# EAGLE schematic analog-io-breakout (EAGLE 8.3.2)
DESIGNER: JAKOB VOIGTS & JON NEWMAN; DESIGN_NAME: BREAKOUT BOARD; LICENSE: CERN OHL v1.2; REVISION: 1.0
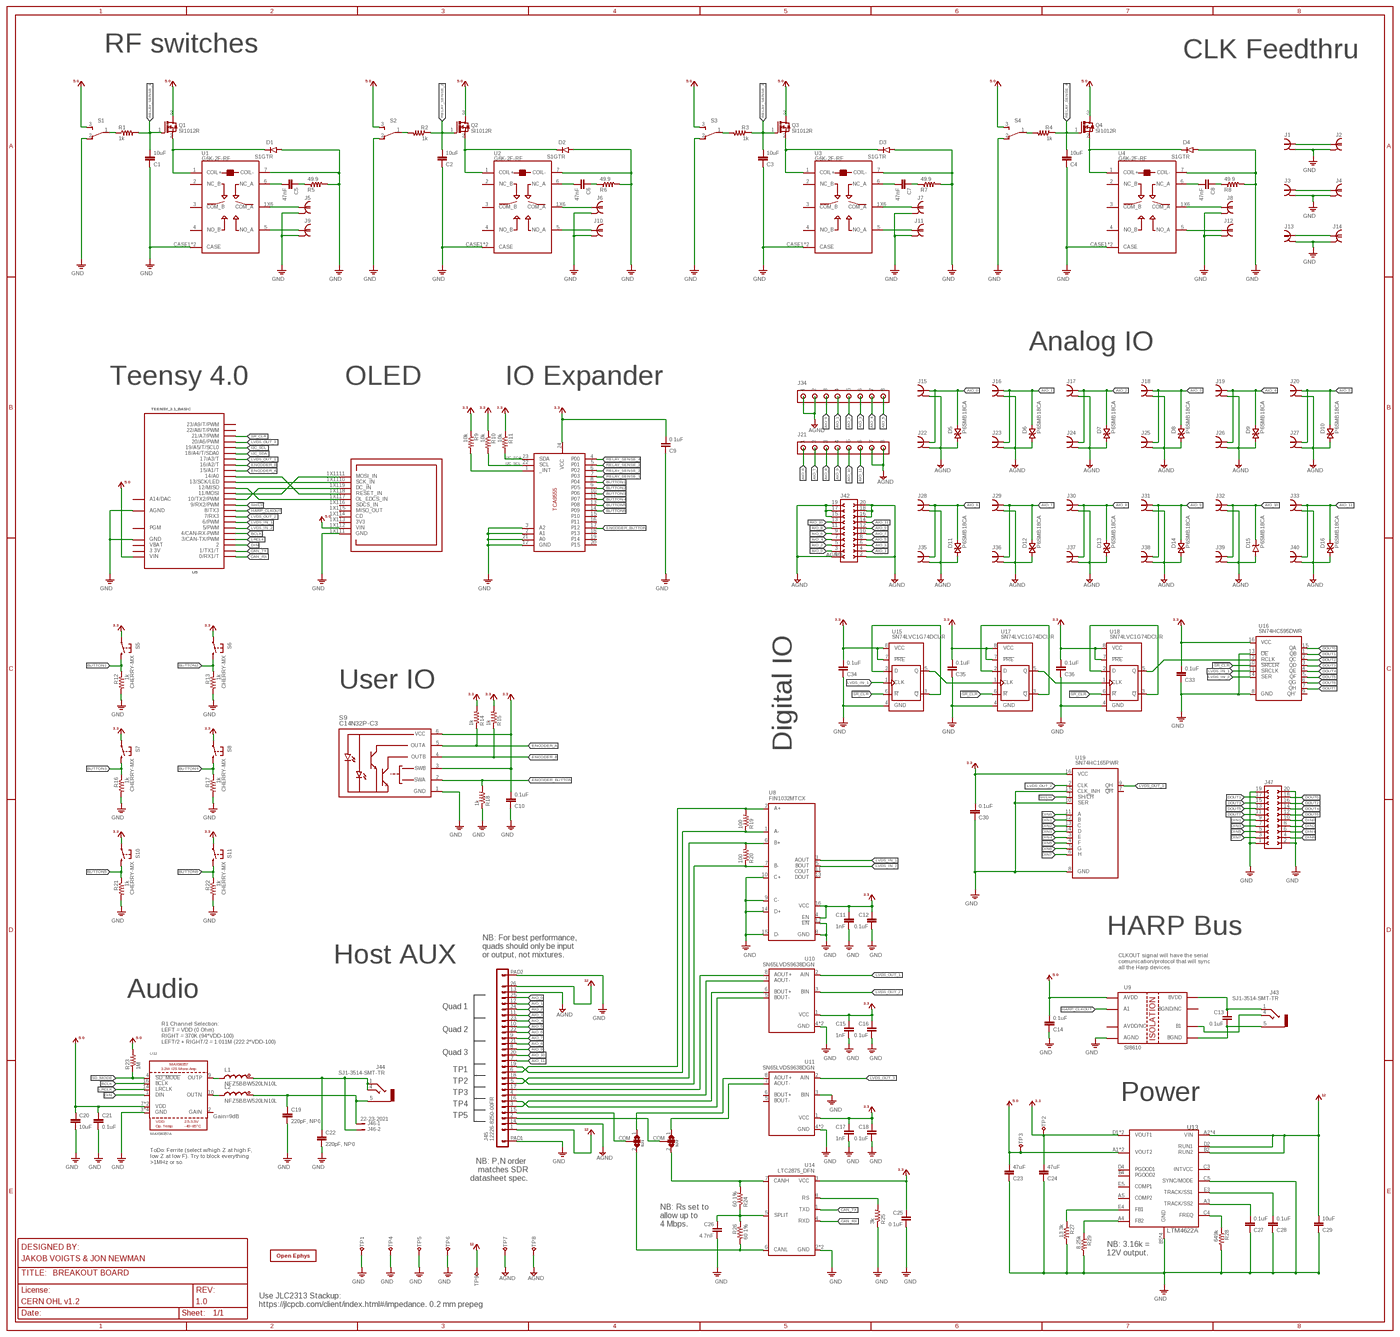
[diagram p0: schematic, sheet 1, overview]
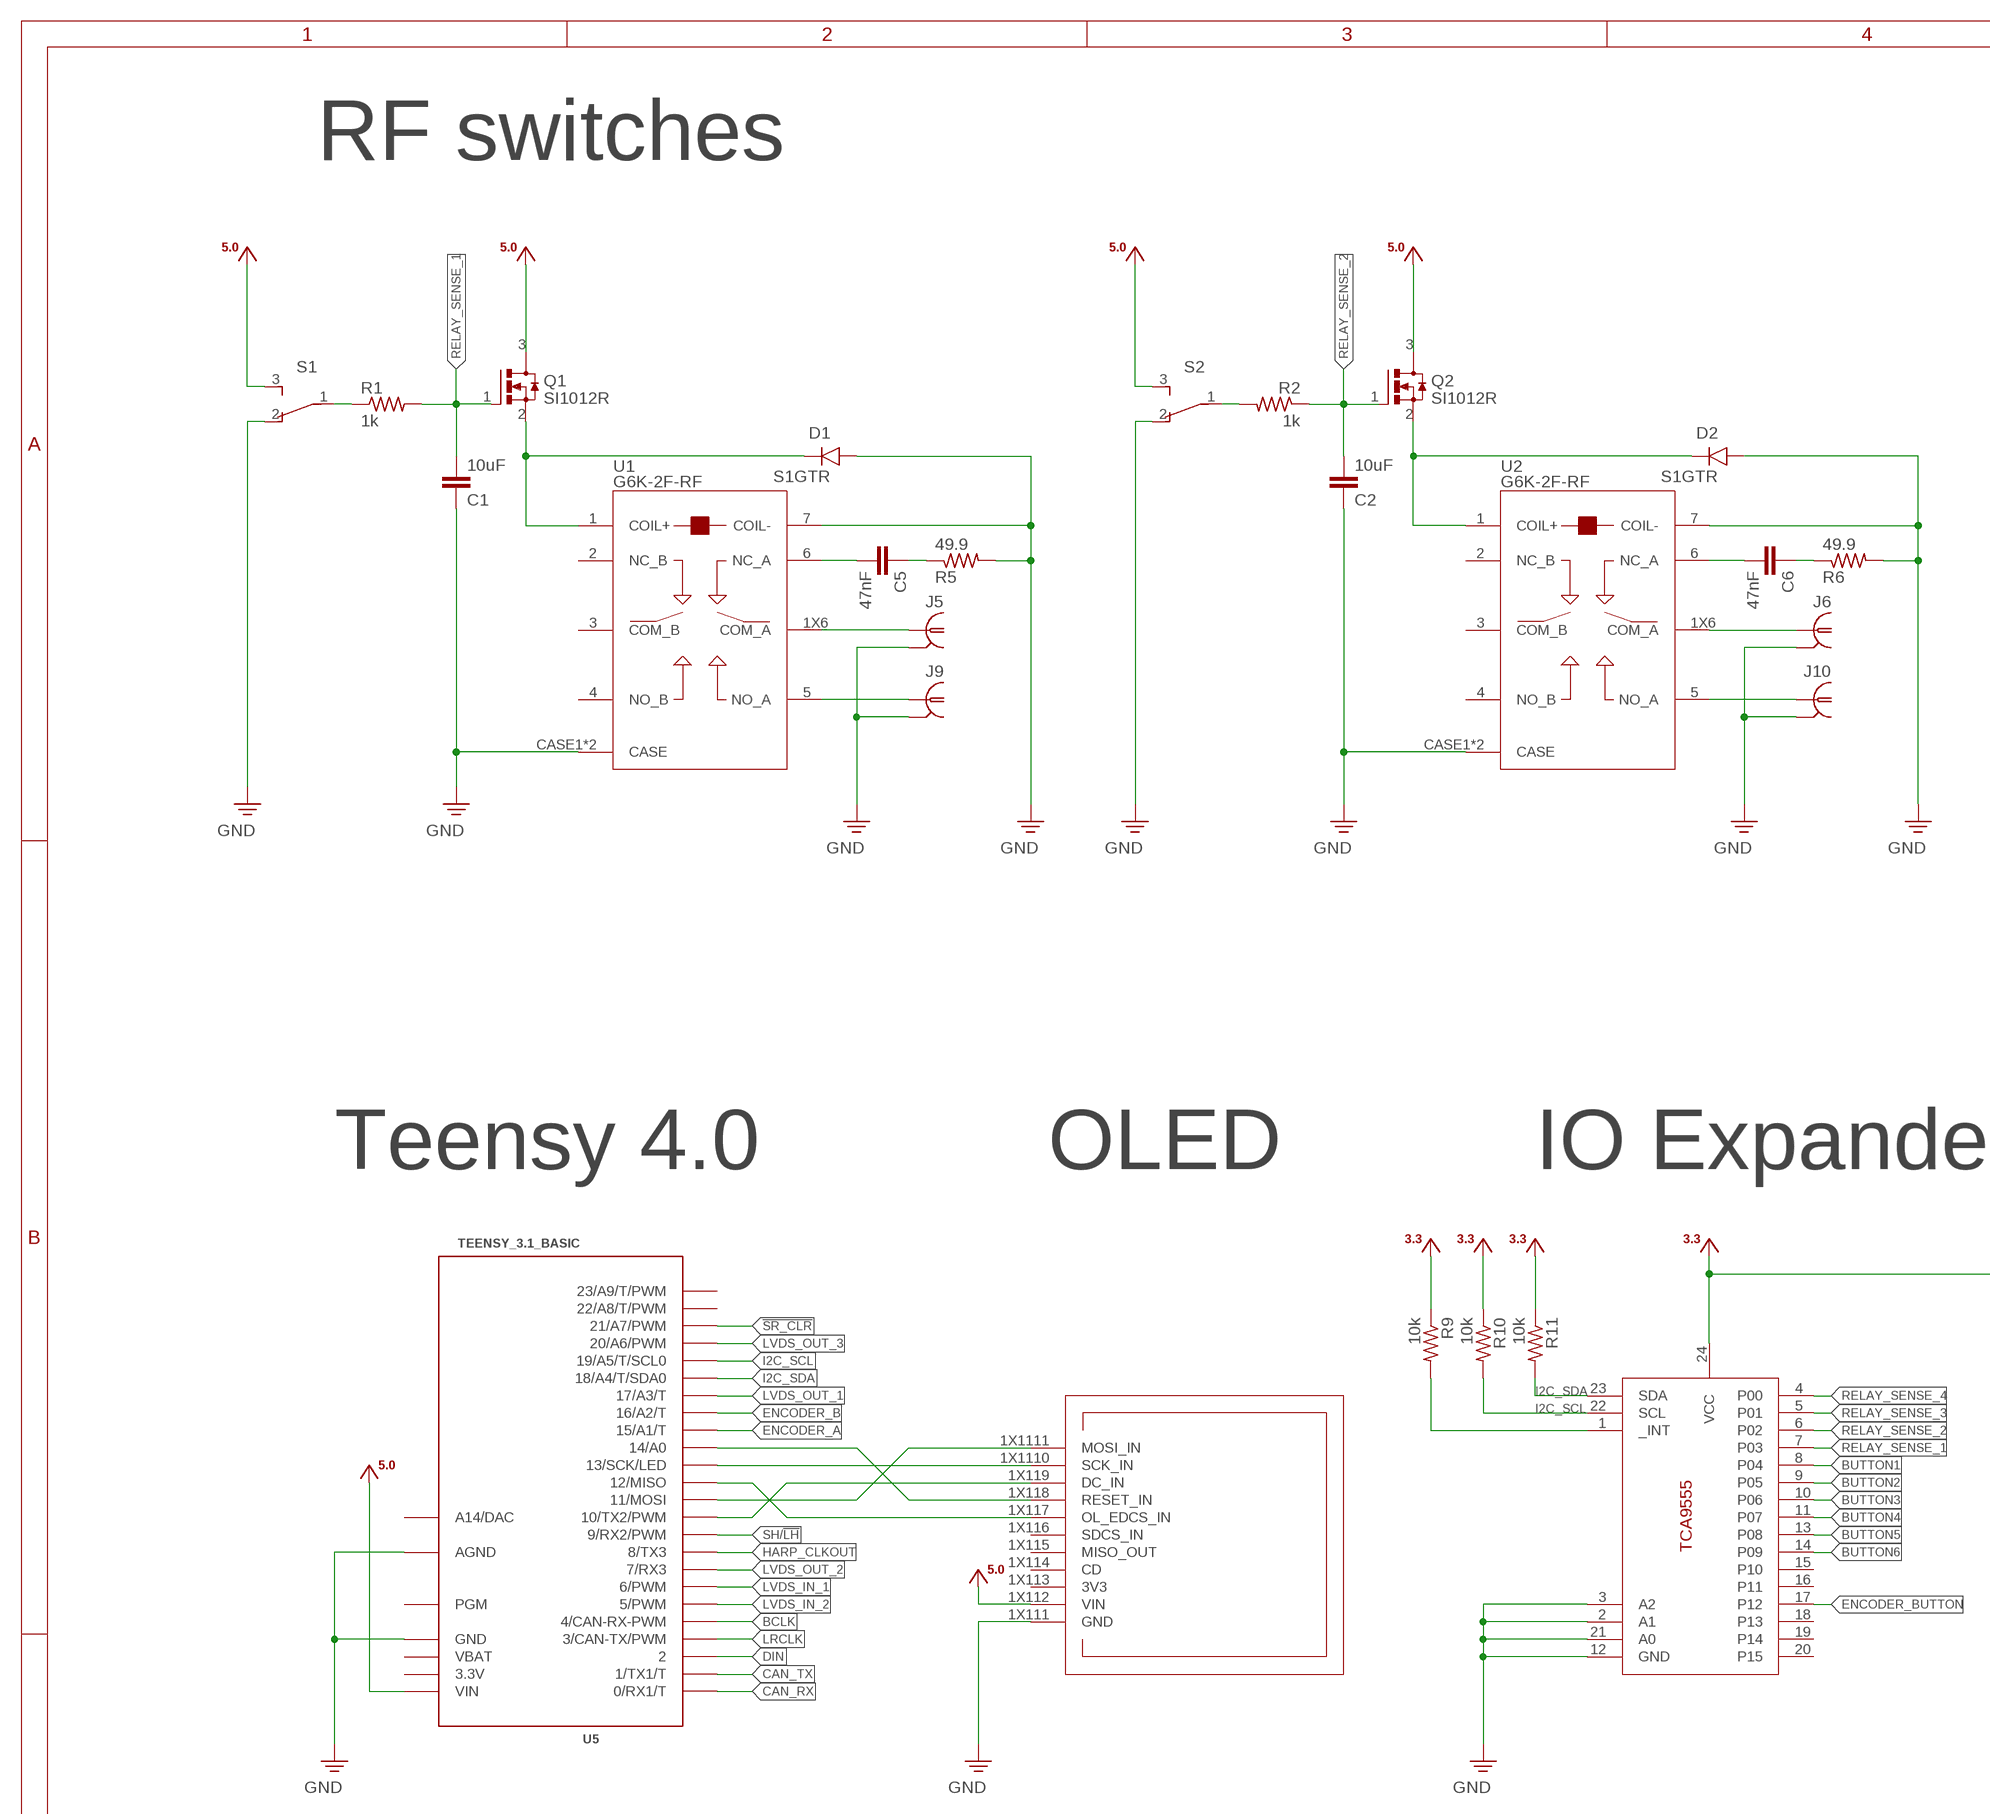
[diagram p1: schematic, sheet 1, part 1 of 4]
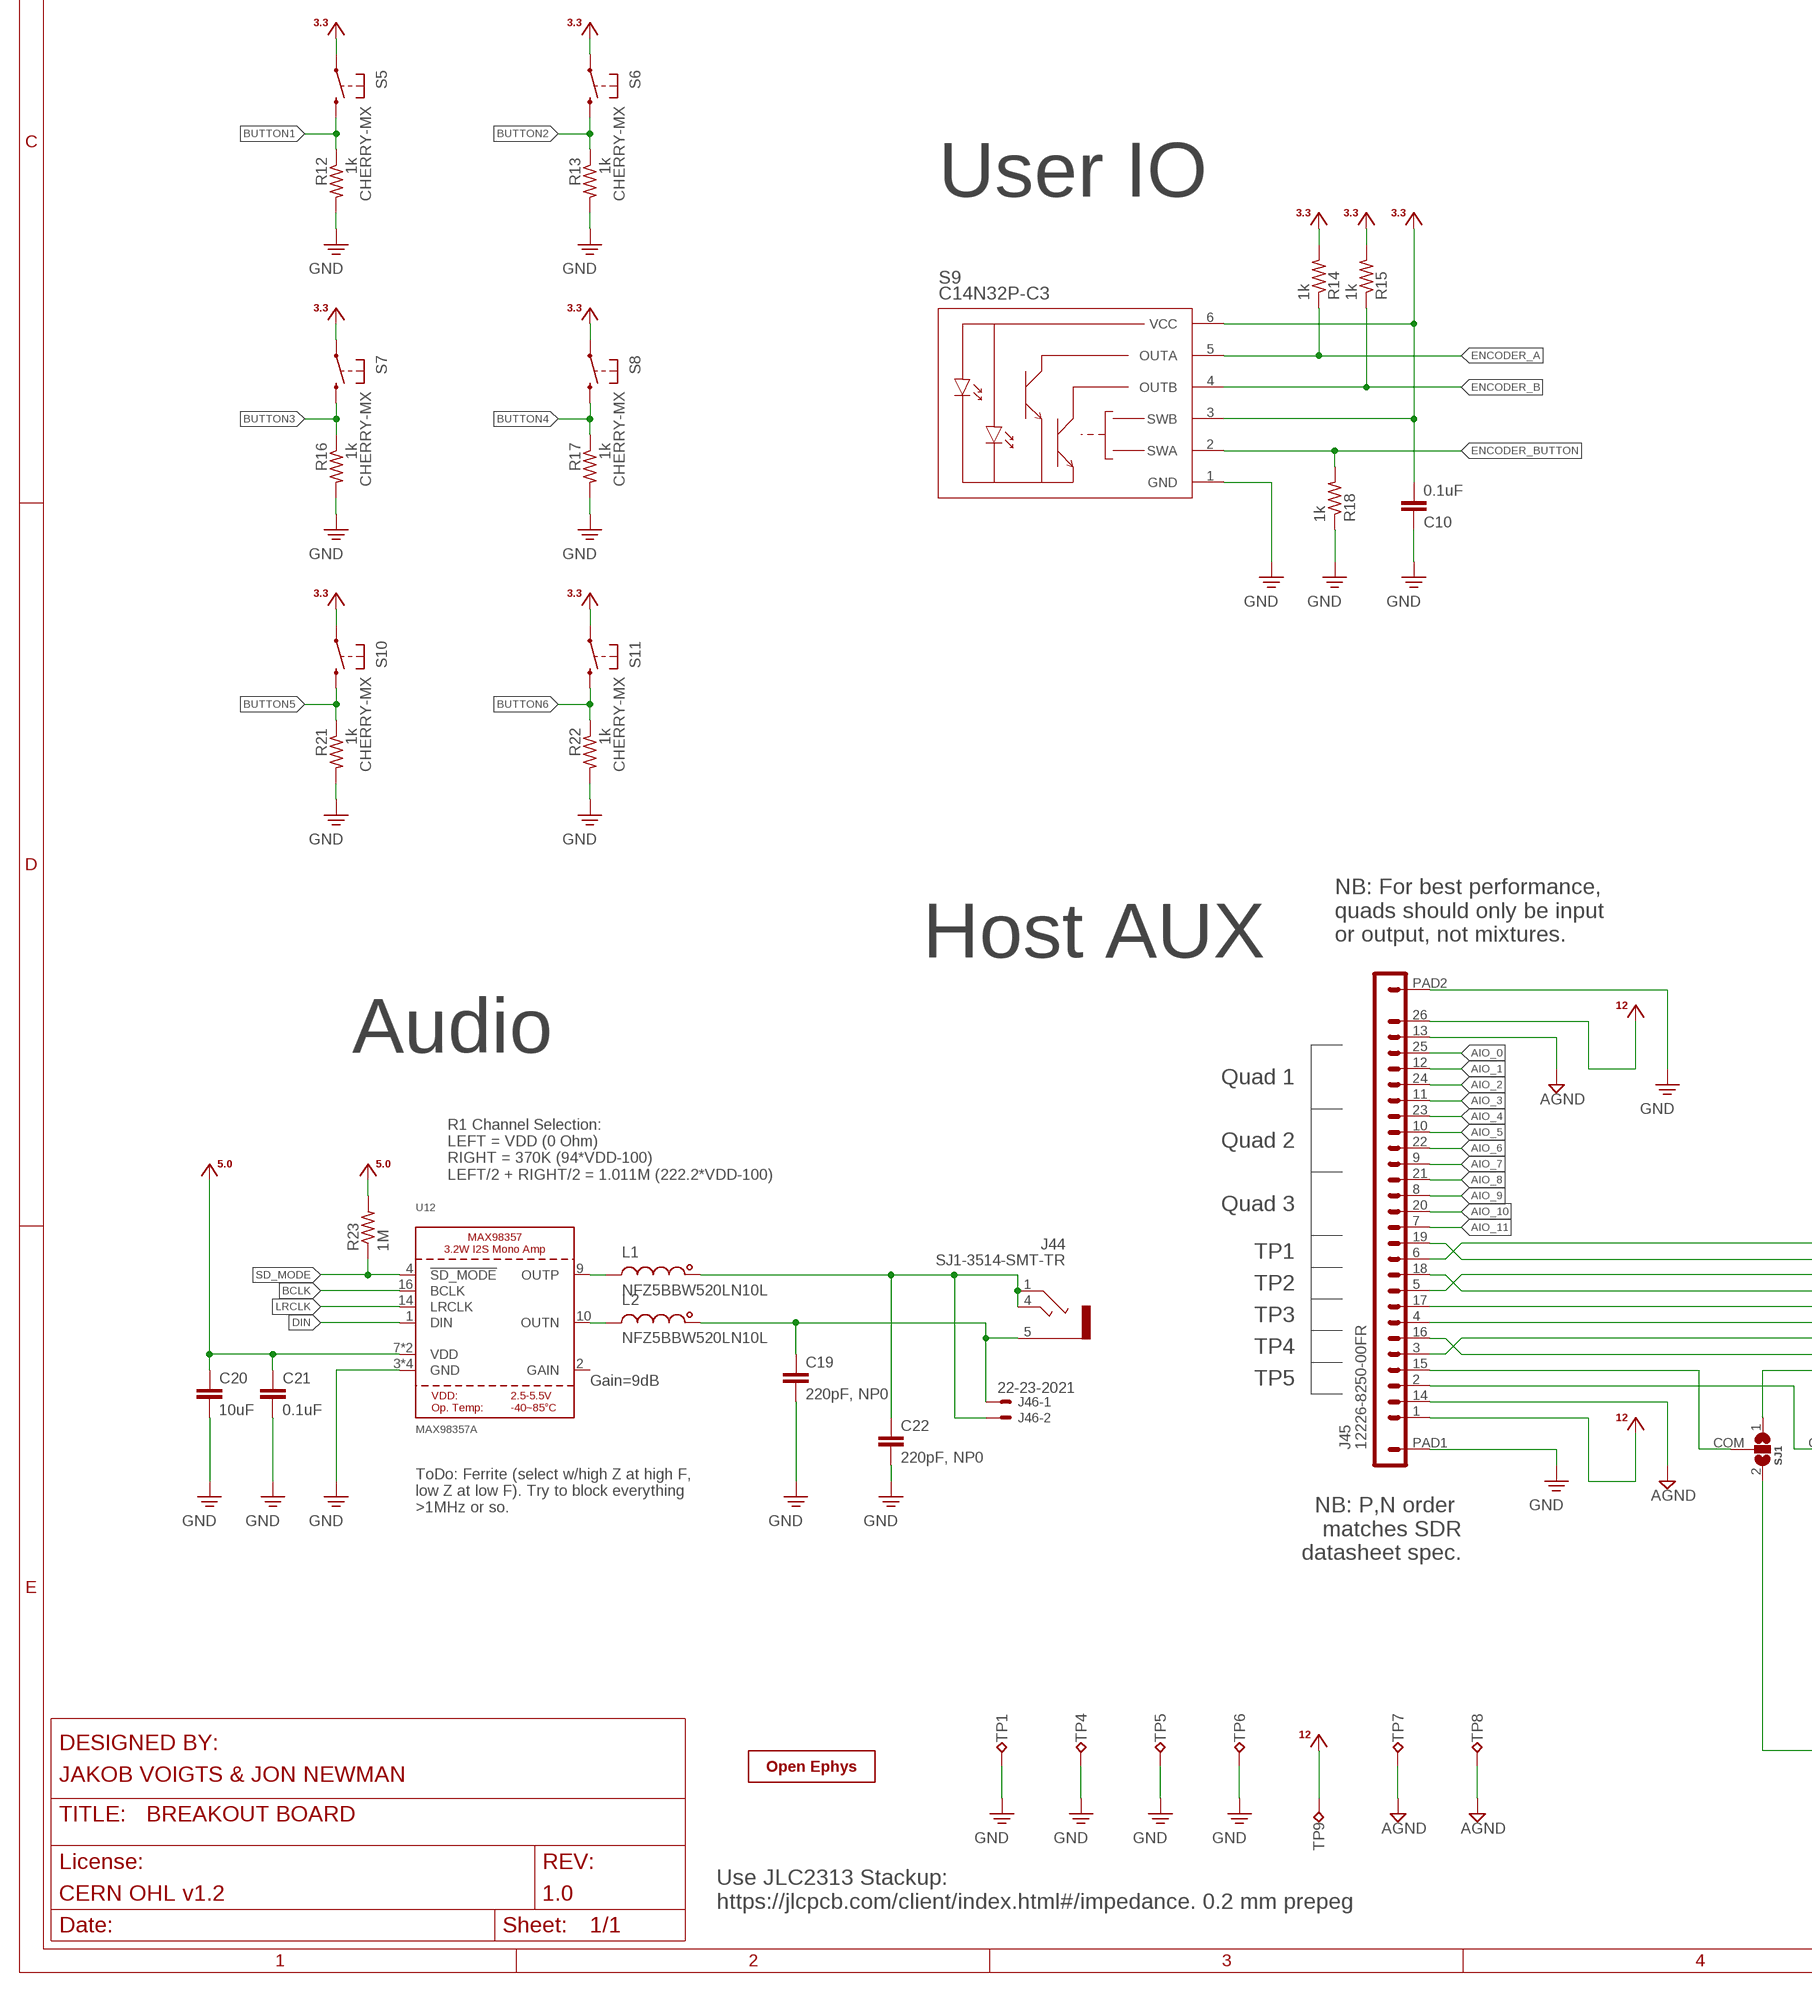
[diagram p2: schematic, sheet 1, part 2 of 4]
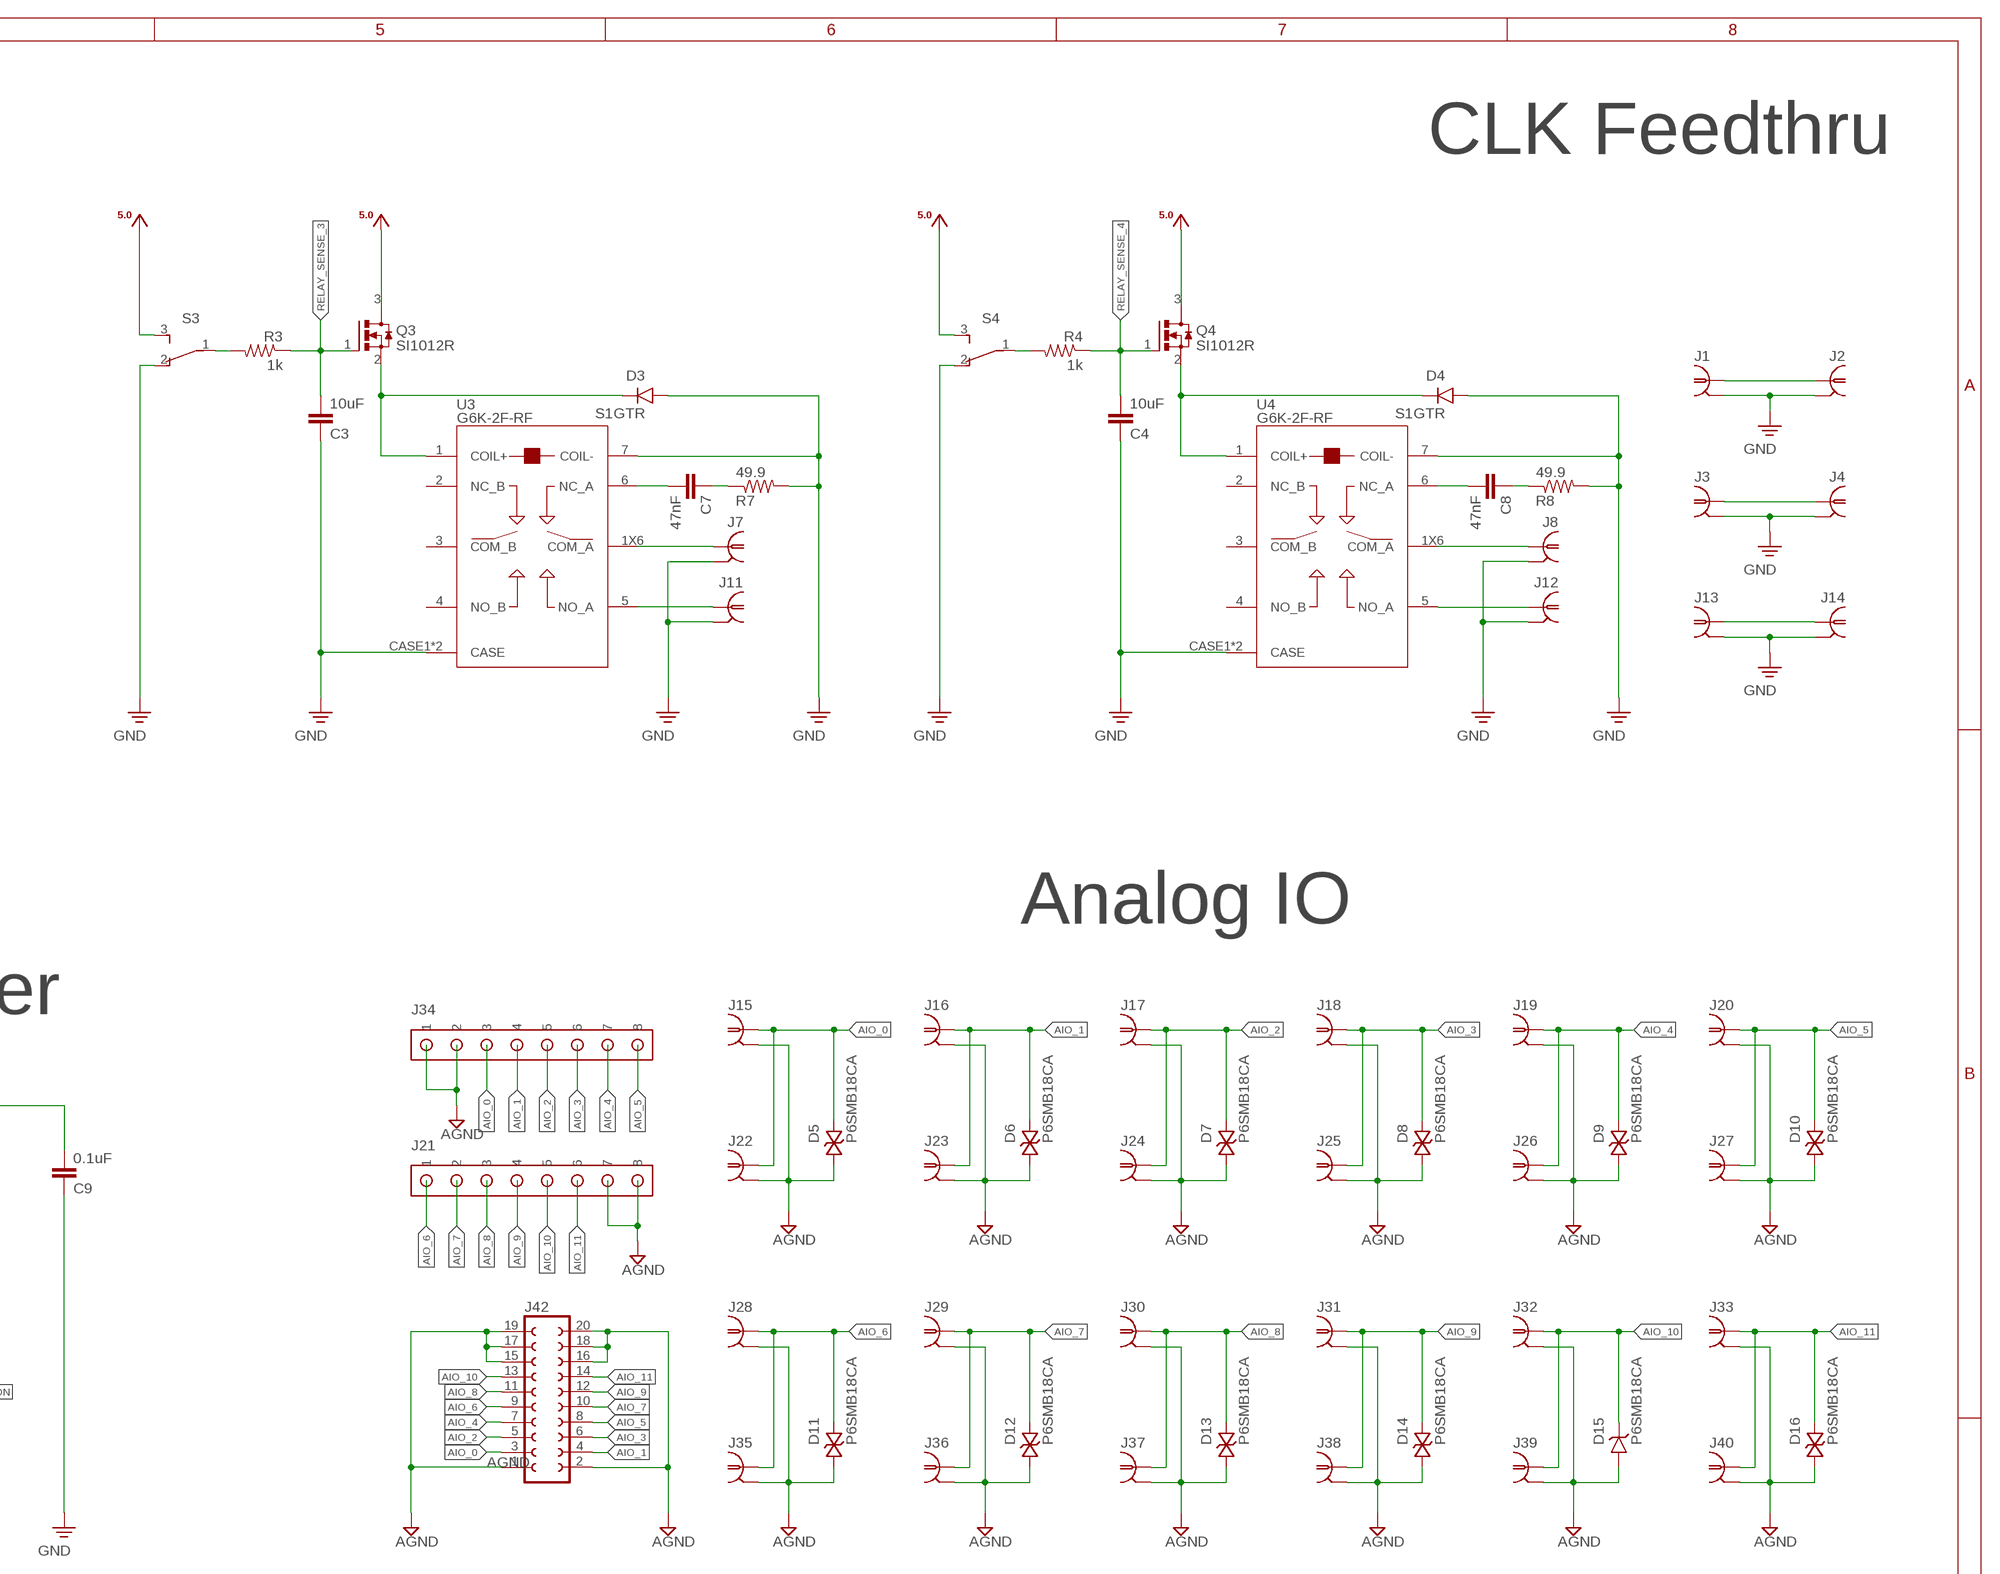
[diagram p3: schematic, sheet 1, part 3 of 4]
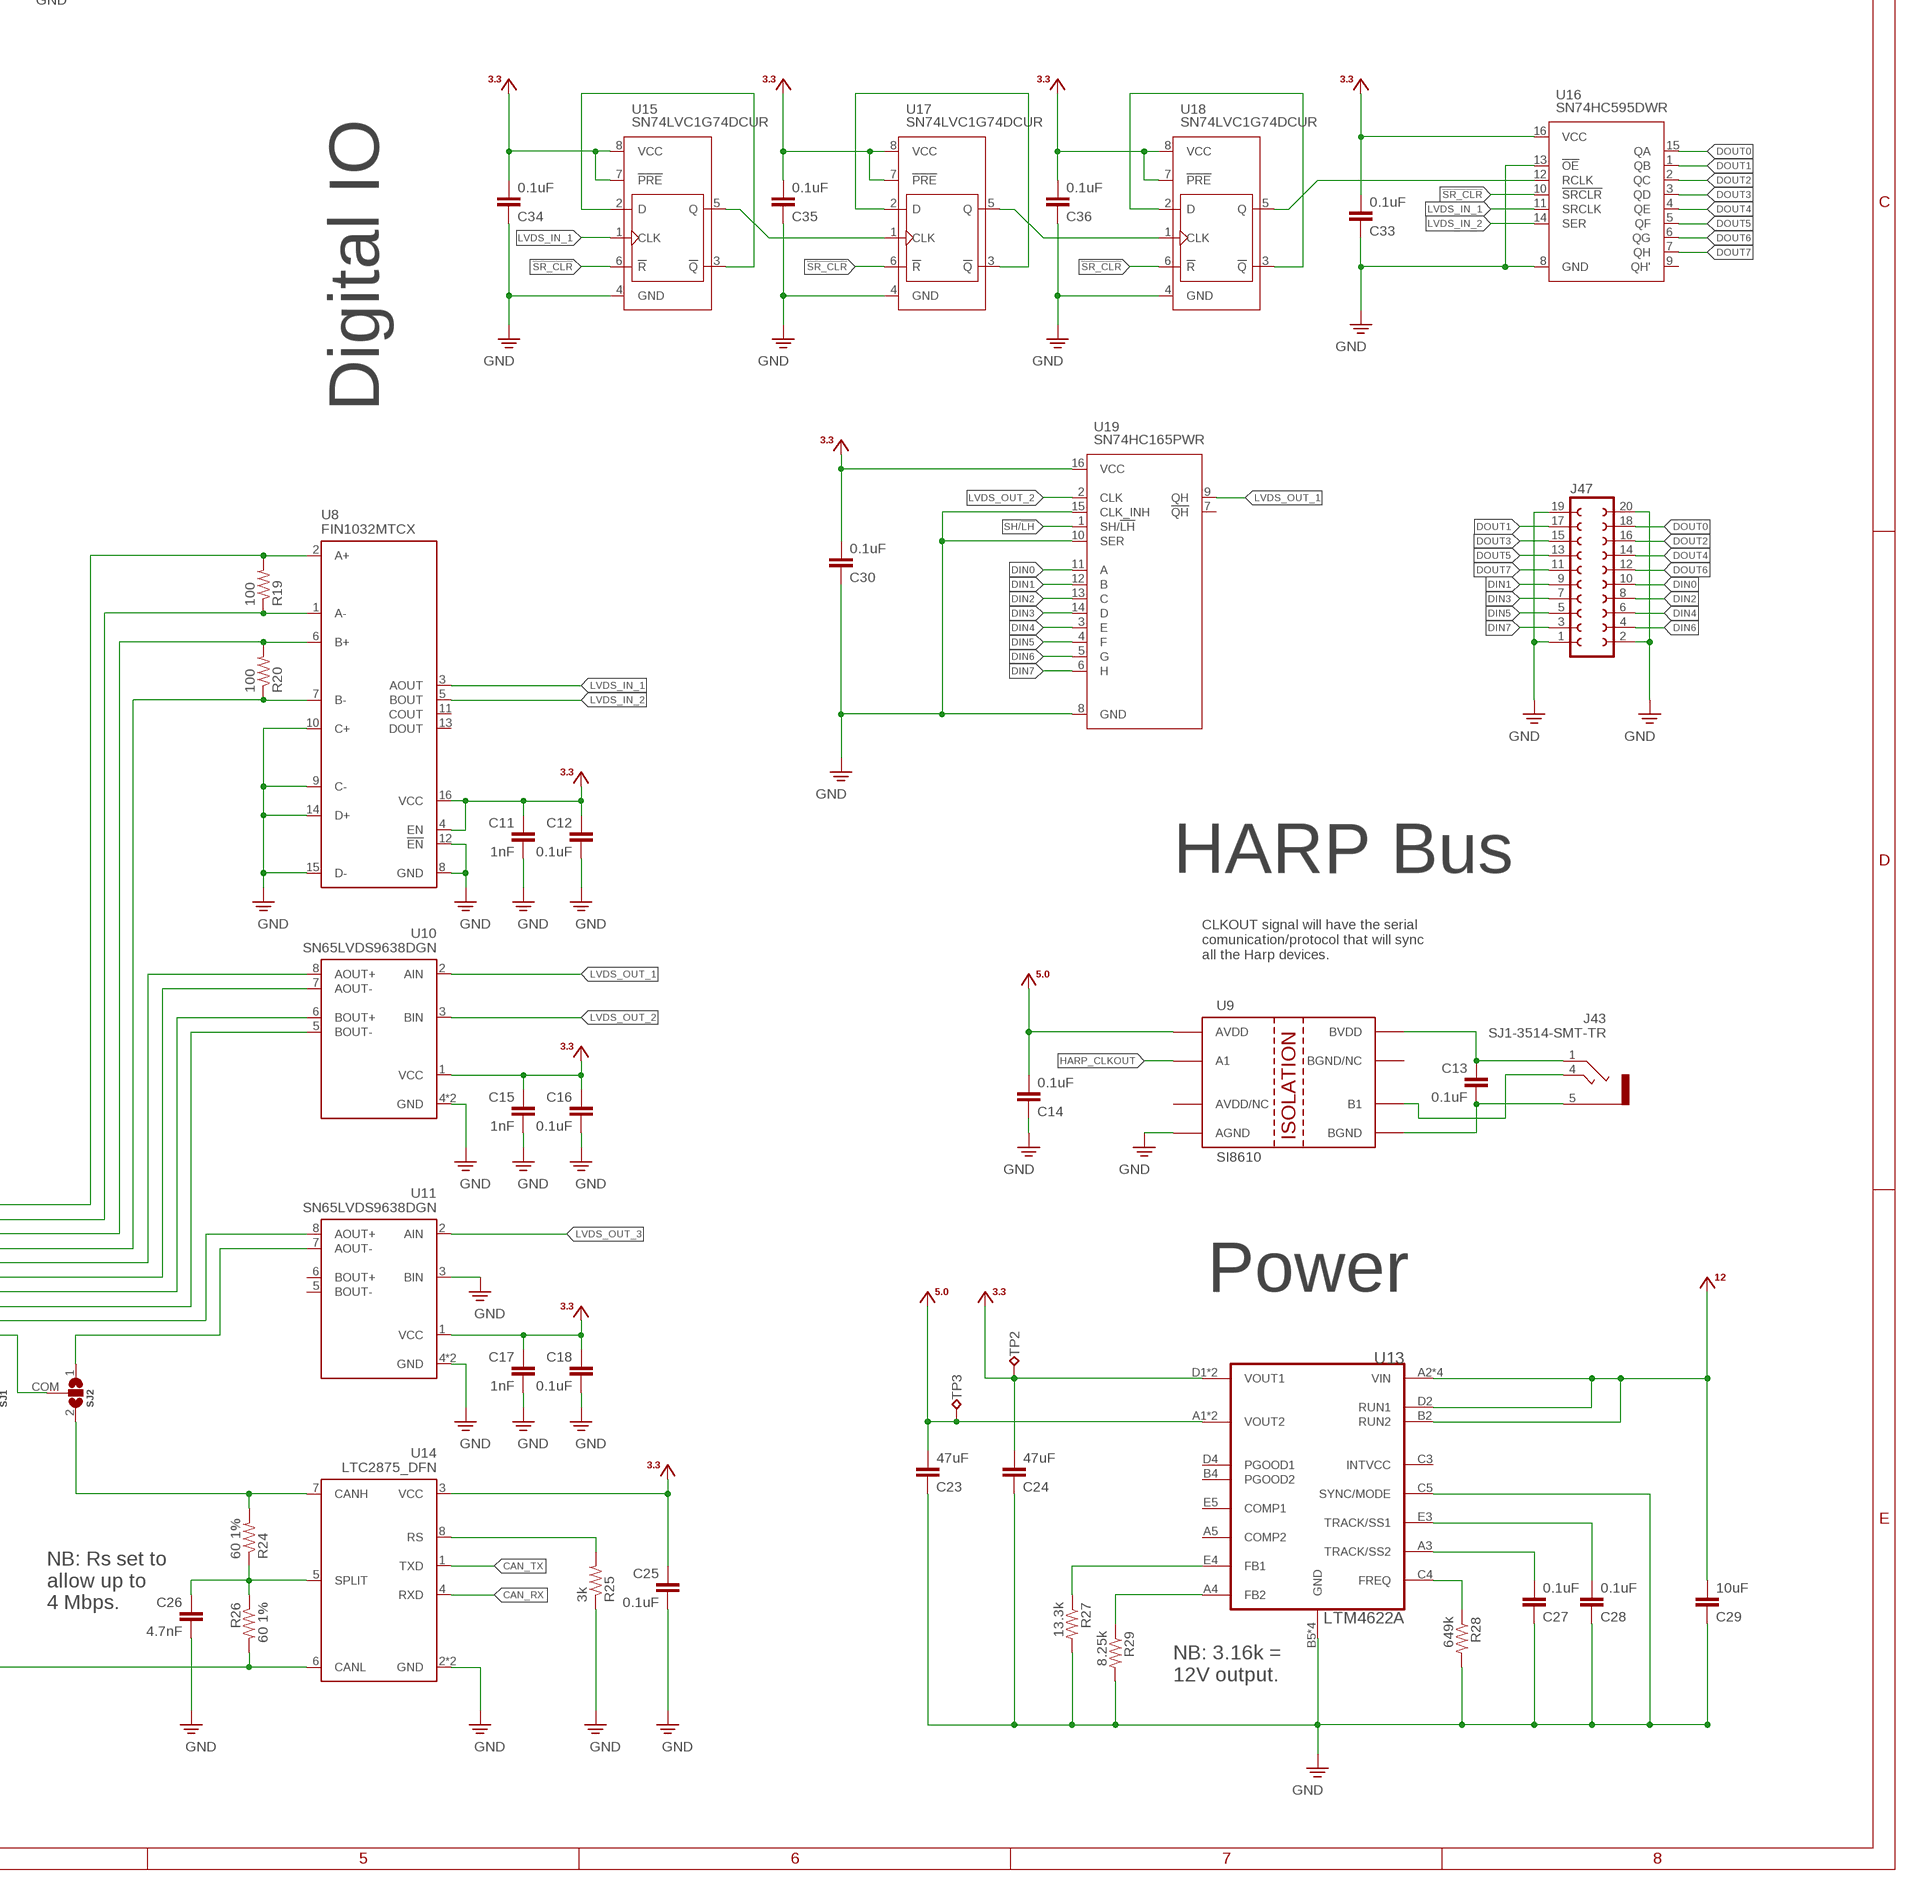
[diagram p4: schematic, sheet 1, part 4 of 4]

## Parts
C1  10uF  C_0805  [0805]
C2  10uF  C_0805  [0805]
C3  10uF  C_0805  [0805]
C4  10uF  C_0805  [0805]
C5  47nF  C_0402  [0402]
C6  47nF  C_0402  [0402]
C7  47nF  C_0402  [0402]
C8  47nF  C_0402  [0402]
C9  0.1uF  C_0402  [0402]
C10  0.1uF  C_0402  [0402]
C11  1nF  C_0402  [0402]
C12  0.1uF  C_0402  [0402]
C13  0.1uF  C_0402  [0402]
C14  0.1uF  C_0402  [0402]
C15  1nF  C_0402  [0402]
C16  0.1uF  C_0402  [0402]
C17  1nF  C_0402  [0402]
C18  0.1uF  C_0402  [0402]
C19  220pF, NP0  C_0402  [0402]
C20  10uF  C_0805  [0805]
C21  0.1uF  C_0402  [0402]
C22  220pF, NP0  C_0402  [0402]
C23  47uF  C_1210  [1210]
C24  47uF  C_1210  [1210]
C25  0.1uF  C_0402  [0402]
C26  4.7nF  C_0402  [0402]
C27  0.1uF  C_0402  [0402]
C28  0.1uF  C_0402  [0402]
C29  10uF  C_0805  [0805]
C30  0.1uF  C_0402  [0402]
C33  0.1uF  C_0402  [0402]
C34  0.1uF  C_0402  [0402]
C35  0.1uF  C_0402  [0402]
C36  0.1uF  C_0402  [0402]
D1  S1GTR  DIODES1B-13-F  [SMA-DO214AC]
D2  S1GTR  DIODES1B-13-F  [SMA-DO214AC]
D3  S1GTR  DIODES1B-13-F  [SMA-DO214AC]
D4  S1GTR  DIODES1B-13-F  [SMA-DO214AC]
D5  P6SMB18CA  TVS-DIODE-BI_DO214  [SMA-DO214AC]
D6  P6SMB18CA  TVS-DIODE-BI_DO214  [SMA-DO214AC]
D7  P6SMB18CA  TVS-DIODE-BI_DO214  [SMA-DO214AC]
D8  P6SMB18CA  TVS-DIODE-BI_DO214  [SMA-DO214AC]
D9  P6SMB18CA  TVS-DIODE-BI_DO214  [SMA-DO214AC]
D10  P6SMB18CA  TVS-DIODE-BI_DO214  [SMA-DO214AC]
D11  P6SMB18CA  TVS-DIODE-BI_DO214  [SMA-DO214AC]
D12  P6SMB18CA  TVS-DIODE-BI_DO214  [SMA-DO214AC]
D13  P6SMB18CA  TVS-DIODE-BI_DO214  [SMA-DO214AC]
D14  P6SMB18CA  TVS-DIODE-BI_DO214  [SMA-DO214AC]
D15  P6SMB18CA  Z-DIODE_DO214  [SMA-DO214AC]
D16  P6SMB18CA  TVS-DIODE-BI_DO214  [SMA-DO214AC]
J1  COAX_MMCX-THRU  [MMCX-THRU]
J2  COAX_SMA-VERT  [SMA_JACK_142-0701-201]
J3  COAX_MMCX-THRU  [MMCX-THRU]
J4  COAX_SMA-VERT  [SMA_JACK_142-0701-201]
J5  COAX_SMA-VERT  [SMA_JACK_142-0701-201]
J6  COAX_SMA-VERT  [SMA_JACK_142-0701-201]
J7  COAX_SMA-VERT  [SMA_JACK_142-0701-201]
J8  COAX_SMA-VERT  [SMA_JACK_142-0701-201]
J9  COAX_MMCX-THRU  [MMCX-THRU]
J10  COAX_MMCX-THRU  [MMCX-THRU]
J11  COAX_MMCX-THRU  [MMCX-THRU]
J12  COAX_MMCX-THRU  [MMCX-THRU]
J13  COAX_MMCX-THRU  [MMCX-THRU]
J14  COAX_SMA-VERT  [SMA_JACK_142-0701-201]
J15  COAX_0731010360  [0731010360]
J16  COAX_0731010360  [0731010360]
J17  COAX_0731010360  [0731010360]
J18  COAX_0731010360  [0731010360]
J19  COAX_0731010360  [0731010360]
J20  COAX_0731010360  [0731010360]
J21  SCREW8  [SCREW8]
J22  COAX_SMA-VERT  [SMA_JACK_142-0701-201]
J23  COAX_SMA-VERT  [SMA_JACK_142-0701-201]
J24  COAX_SMA-VERT  [SMA_JACK_142-0701-201]
J25  COAX_SMA-VERT  [SMA_JACK_142-0701-201]
J26  COAX_SMA-VERT  [SMA_JACK_142-0701-201]
J27  COAX_SMA-VERT  [SMA_JACK_142-0701-201]
J28  COAX_0731010360  [0731010360]
J29  COAX_0731010360  [0731010360]
J30  COAX_0731010360  [0731010360]
J31  COAX_0731010360  [0731010360]
J32  COAX_0731010360  [0731010360]
J33  COAX_0731010360  [0731010360]
J34  SCREW8  [SCREW8]
J35  COAX_SMA-VERT  [SMA_JACK_142-0701-201]
J36  COAX_SMA-VERT  [SMA_JACK_142-0701-201]
J37  COAX_SMA-VERT  [SMA_JACK_142-0701-201]
J38  COAX_SMA-VERT  [SMA_JACK_142-0701-201]
J39  COAX_SMA-VERT  [SMA_JACK_142-0701-201]
J40  COAX_SMA-VERT  [SMA_JACK_142-0701-201]
J42  FE10-2  [FE10-2]
J43  SJ1-3514-SMT-TR  STEREO_JACK  [35RASMT2BHNTRX]
J44  SJ1-3514-SMT-TR  STEREO_JACK  [35RASMT2BHNTRX]
J45  12226-8250-00FR  PINHD-1X26_122  [12226-82X0-00XX]
J46  22-23-2021  [22-23-2021]
J47  FE10-2  [FE10-2]
L1  NFZ5BBW520LN10L  L_2020  [2020]
L2  NFZ5BBW520LN10L  L_2020  [2020]
Q1  SI1012R  N-MOSFET_SC75-GSD  [SC75]
Q2  SI1012R  N-MOSFET_SC75-GSD  [SC75]
Q3  SI1012R  N-MOSFET_SC75-GSD  [SC75]
Q4  SI1012R  N-MOSFET_SC75-GSD  [SC75]
R1  1k  R_0402  [0402]
R2  1k  R_0402  [0402]
R3  1k  R_0402  [0402]
R4  1k  R_0402  [0402]
R5  49.9  R_0402  [0402]
R6  49.9  R_0402  [0402]
R7  49.9  R_0402  [0402]
R8  49.9  R_0402  [0402]
R9  10k  R_0402  [0402]
R10  10k  R_0402  [0402]
R11  10k  R_0402  [0402]
R12  1k  R_0402  [0402]
R13  1k  R_0402  [0402]
R14  1k  R_0402  [0402]
R15  1k  R_0402  [0402]
R16  1k  R_0402  [0402]
R17  1k  R_0402  [0402]
R18  1k  R_0402  [0402]
R19  100  R_0402  [0402]
R20  100  R_0402  [0402]
R21  1k  R_0402  [0402]
R22  1k  R_0402  [0402]
R23  1M  R_0402  [0402]
R24  60 1%  R_0402  [0402]
R25  3k  R_0402  [0402]
R26  60 1%  R_0402  [0402]
R27  13.3k  R_0402  [0402]
R28  649k  R_0402  [0402]
R29  8.25k  R_0402  [0402]
S1  SPDT_CK-710  [CK_7101J1V3QE2]
S2  SPDT_CK-710  [CK_7101J1V3QE2]
S3  SPDT_CK-710  [CK_7101J1V3QE2]
S4  SPDT_CK-710  [CK_7101J1V3QE2]
S5  CHERRY-MX  SPST_TACT2_CHERRY-MX  [CHERRY-MX]
S6  CHERRY-MX  SPST_TACT2_CHERRY-MX  [CHERRY-MX]
S7  CHERRY-MX  SPST_TACT2_CHERRY-MX  [CHERRY-MX]
S8  CHERRY-MX  SPST_TACT2_CHERRY-MX  [CHERRY-MX]
S9  C14N32P-C3  [C14N32P-C3]
S10  CHERRY-MX  SPST_TACT2_CHERRY-MX  [CHERRY-MX]
S11  CHERRY-MX  SPST_TACT2_CHERRY-MX  [CHERRY-MX]
SJ1  SJ2_0201  [SJ_2_0201]
SJ2  SJ2_0201  [SJ_2_0201]
TP1  TP_2MM  [TESTPOINT_2MM]
TP2  TPB1,27  [B1,27]
TP3  TPB1,27  [B1,27]
TP4  TP_2MM  [TESTPOINT_2MM]
TP5  TP_2MM  [TESTPOINT_2MM]
TP6  TP_2MM  [TESTPOINT_2MM]
TP7  TP_2MM  [TESTPOINT_2MM]
TP8  TP_2MM  [TESTPOINT_2MM]
TP9  TPTP12R  [TP12R]
U1  G6K-2F-RF  G6KU-2F-RF-TR09DC5  [G6KU-2F-RF]
U2  G6K-2F-RF  G6KU-2F-RF-TR09DC5  [G6KU-2F-RF]
U3  G6K-2F-RF  G6KU-2F-RF-TR09DC5  [G6KU-2F-RF]
U4  G6K-2F-RF  G6KU-2F-RF-TR09DC5  [G6KU-2F-RF]
U5  TEENSY_3.1_BASIC  [TEENSY_3.1_BASIC]
U6  ADAFRUIT_1_5_OLED  [ADAFRUIT_1_5_OLED]
U7  TCA9555  [TSSOP-24]
U8  FIN1032MTCX  LVDS_RECEIVER_QUAD_TSSOP  [TSSOP-16]
U9  SI8610  [SO-08]
U10  SN65LVDS9638DGN  LVDS_DRIVER_DUAL_MSOP  [MSOP-8-PAD-3X3]
U11  SN65LVDS9638DGN  LVDS_DRIVER_DUAL_MSOP  [MSOP-8-PAD-3X3]
U12  MAX98357A  AUDIOAMP_MAX98357  [QFN16_3MM]
U13  LTM4622A  LTM4622_BGA  [BGA_5X5_625X625]
U14  LTC2875_DFN  [DFN83X3]
U15  SN74LVC1G74DCUR  D-FLIP-FLOP_VSSOP  [VSSOP-N8-3X3]
U16  SN74HC595DWR  SNX4HC595_TSSOP  [TSSOP-16]
U17  SN74LVC1G74DCUR  D-FLIP-FLOP_VSSOP  [VSSOP-N8-3X3]
U18  SN74LVC1G74DCUR  D-FLIP-FLOP_VSSOP  [VSSOP-N8-3X3]
U19  SN74HC165PWR  SNX4HC165_TSSOP  [TSSOP-16]
X  OE-LOGO_28X20  [OE-LOGO-28X20]

## Nets
!SR_CLR: U5.21/A7(21/A7/PWM) U15.6(!R) U16.10(!SRCLR) U17.6(!R) U18.6(!R)
+3V3: C9.2 C10.2 C11.1 C12.1 C15.1 C16.1 C17.1 C18.1 C24.2 C25.1 C30.2 C33.2 C34.2 C35.2 C36.2 R9.1 R10.1 R11.1 R14.2 R15.2 S5.SW1(P) S6.SW1(P) S7.SW1(P) S8.SW1(P) S9.3(SWB) S9.6(VCC) S10.SW1(P) S11.SW1(P) TP2.TP U7.24(VCC) U8.4(EN) U8.16(VCC) U10.1(VCC) U11.1(VCC) U13.D1(VOUT1) U13.E1(VOUT1) U14.3(VCC) U15.7(!PRE) U15.8(VCC) U16.16(VCC) U17.7(!PRE) U17.8(VCC) U18.7(!PRE) U18.8(VCC) U19.16(VCC)
+5V0: C14.2 C20.1 C21.1 C23.2 Q1.3(D) Q2.3(D) Q3.3(D) Q4.3(D) R23.2 S1.3 S2.3 S3.3 S4.3 TP3.TP U5.VIN U6.1X112(VIN) U9.1(AVDD) U12.7(VDD) U12.8(VDD) U13.A1(VOUT2) U13.B1(VOUT2)
+12V: C29.2 J45.1 J45.26 TP9.TP U13.A2(VIN) U13.B2(RUN2) U13.B3(VIN) U13.D2(RUN1) U13.D3(VIN) U13.E2(VIN)
AGND: D5.A D6.A D7.A D8.A D9.A D10.A D11.A D12.A D13.A D14.A D15.A D16.A J15.2 J15.3 J15.4 J15.5 J16.2 J16.3 J16.4 J16.5 J17.2 J17.3 J17.4 J17.5 J18.2 J18.3 J18.4 J18.5 J19.2 J19.3 J19.4 J19.5 J20.2 J20.3 J20.4 J20.5 J21.7 J21.8 J22.GND$1 J22.GND$2 J22.GND$3 J22.GND$4 J23.GND$1 J23.GND$2 J23.GND$3 J23.GND$4 J24.GND$1 J24.GND$2 J24.GND$3 J24.GND$4 J25.GND$1 J25.GND$2 J25.GND$3 J25.GND$4 J26.GND$1 J26.GND$2 J26.GND$3 J26.GND$4 J27.GND$1 J27.GND$2 J27.GND$3 J27.GND$4 J28.2 J28.3 J28.4 J28.5 J29.2 J29.3 J29.4 J29.5 J30.2 J30.3 J30.4 J30.5 J31.2 J31.3 J31.4 J31.5 J32.2 J32.3 J32.4 J32.5 J33.2 J33.3 J33.4 J33.5 J34.1 J34.2 J35.GND$1 J35.GND$2 J35.GND$3 J35.GND$4 J36.GND$1 J36.GND$2 J36.GND$3 J36.GND$4 J37.GND$1 J37.GND$2 J37.GND$3 J37.GND$4 J38.GND$1 J38.GND$2 J38.GND$3 J38.GND$4 J39.GND$1 J39.GND$2 J39.GND$3 J39.GND$4 J40.GND$1 J40.GND$2 J40.GND$3 J40.GND$4 J42.1 J42.2 J42.15 J42.16 J42.17 J42.18 J42.19 J42.20 J45.13 J45.14 TP7.1(TP) TP8.1(TP)
AIO_0: D5.C J15.1 J22.CLK J34.3 J42.3 J45.25
AIO_1: D6.C J16.1 J23.CLK J34.4 J42.4 J45.12
AIO_2: D7.C J17.1 J24.CLK J34.5 J42.5 J45.24
AIO_3: D8.C J18.1 J25.CLK J34.6 J42.6 J45.11
AIO_4: D9.C J19.1 J26.CLK J34.7 J42.7 J45.23
AIO_5: D10.C J20.1 J27.CLK J34.8 J42.8 J45.10
AIO_6: D11.C J21.1 J28.1 J35.CLK J42.9 J45.22
AIO_7: D12.C J21.2 J29.1 J36.CLK J42.10 J45.9
AIO_8: D13.C J21.3 J30.1 J37.CLK J42.11 J45.21
AIO_9: D14.C J21.4 J31.1 J38.CLK J42.12 J45.8
AIO_10: D15.C J21.5 J32.1 J39.CLK J42.13 J45.20
AIO_11: D16.C J21.6 J33.1 J40.CLK J42.14 J45.7
BCLK: U5.4(4/CAN-RX-PWM) U12.16(BCLK)
BUTTON1: R12.1 S5.SW2(S) U7.8(P04)
BUTTON2: R13.1 S6.SW2(S) U7.9(P05)
BUTTON3: R16.1 S7.SW2(S) U7.10(P06)
BUTTON4: R17.1 S8.SW2(S) U7.11(P07)
BUTTON5: R21.1 S10.SW2(S) U7.13(P08)
BUTTON6: R22.1 S11.SW2(S) U7.14(P09)
CAN_N [100 Ohm Diff Mid]: R26.2 SJ1.2 U14.6(CANL)
CAN_P [100 Ohm Diff Mid]: R24.2 SJ2.2 U14.7(CANH)
CAN_RX: U5.0(0/RX1/T) U14.4(RXD)
CAN_TX: U5.1(1/TX1/T) U14.1(TXD)
CLK/8: U16.12(RCLK) U18.5(Q)
DIN: U5.2 U12.1(DIN)
DIN0: J47.10 U19.11(A)
DIN1: J47.9 U19.12(B)
DIN2: J47.8 U19.13(C)
DIN3: J47.7 U19.14(D)
DIN4: J47.6 U19.3(E)
DIN5: J47.5 U19.4(F)
DIN6: J47.4 U19.5(G)
DIN7: J47.3 U19.6(H)
DOUT0: J47.18 U16.15(QA)
DOUT1: J47.17 U16.1(QB)
DOUT2: J47.16 U16.2(QC)
DOUT3: J47.15 U16.3(QD)
DOUT4: J47.14 U16.4(QE)
DOUT5: J47.13 U16.5(QF)
DOUT6: J47.12 U16.6(QG)
DOUT7: J47.11 U16.7(QH)
ENCODER_A: R14.1 S9.5(OUTA) U5.15/A1(15/A1/T)
ENCODER_B: R15.1 S9.4(OUTB) U5.16/A2(16/A2/T)
ENCODER_BUTTON: R18.2 S9.2(SWA) U7.17(P12)
GND: C1.1 C2.1 C3.1 C4.1 C9.1 C10.1 C11.2 C12.2 C14.1 C15.2 C16.2 C17.2 C18.2 C19.2 C20.2 C21.2 C22.2 C23.1 C24.1 C25.2 C26.2 C27.1 C28.1 C29.1 C30.1 C33.1 C34.1 C35.1 C36.1 D1.A D2.A D3.A D4.A J1.GND@1 J1.GND@2 J1.GND@3 J1.GND@4 J2.GND$1 J2.GND$2 J2.GND$3 J2.GND$4 J3.GND@1 J3.GND@2 J3.GND@3 J3.GND@4 J4.GND$1 J4.GND$2 J4.GND$3 J4.GND$4 J5.GND$1 J5.GND$2 J5.GND$3 J5.GND$4 J6.GND$1 J6.GND$2 J6.GND$3 J6.GND$4 J7.GND$1 J7.GND$2 J7.GND$3 J7.GND$4 J8.GND$1 J8.GND$2 J8.GND$3 J8.GND$4 J9.GND@1 J9.GND@2 J9.GND@3 J9.GND@4 J10.GND@1 J10.GND@2 J10.GND@3 J10.GND@4 J11.GND@1 J11.GND@2 J11.GND@3 J11.GND@4 J12.GND@1 J12.GND@2 J12.GND@3 J12.GND@4 J13.GND@1 J13.GND@2 J13.GND@3 J13.GND@4 J14.GND$1 J14.GND$2 J14.GND$3 J14.GND$4 J45.PAD1 J45.PAD2 J47.1 J47.2 J47.19 J47.20 R5.2 R6.2 R7.2 R8.2 R12.2 R13.2 R16.2 R17.2 R18.1 R21.2 R22.2 R25.1 R27.2 R28.2 R29.2 S1.2 S2.2 S3.2 S4.2 S9.1(GND) TP1.1(TP) TP4.1(TP) TP5.1(TP) TP6.1(TP) U1.7(COIL-) U1.CASE1(CASE) U1.CASE2(CASE) U2.7(COIL-) U2.CASE1(CASE) U2.CASE2(CASE) U3.7(COIL-) U3.CASE1(CASE) U3.CASE2(CASE) U4.7(COIL-) U4.CASE1(CASE) U4.CASE2(CASE) U5.AGND U5.GND U5.GND1(GND) U6.1X111(GND) U7.2(A1) U7.3(A2) U7.12(GND) U7.21(A0) U8.8(GND) U8.9(C-) U8.10(C+) U8.12(!EN) U8.14(D+) U8.15(D-) U9.4(AGND) U10.4(GND) U10.PAD(GND) U11.3(BIN) U11.4(GND) U11.PAD(GND) U12.3(GND) U12.11(GND) U12.15(GND) U12.THERMAL(GND) U13.B5(GND) U13.C1(GND) U13.C2(GND) U13.C5(SYNC/MODE) U13.D5(GND) U14.2(GND) U14.PAD(GND) U15.4(GND) U16.8(GND) U16.13(!OE) U17.4(GND) U18.4(GND) U19.8(GND) U19.10(SER) U19.15(CLK_INH)
HARP_CLKOUT: U5.8(8/TX3) U9.2(A1)
I2C_SCL: R10.2 U5.19/A5(19/A5/T/SCL0) U7.22(SCL)
I2C_SDA: R11.2 U5.18/A4(18/A4/T/SDA0) U7.23(SDA)
LRCLK: U5.3(3/CAN-TX/PWM) U12.14(LRCLK)
LVDS_DIN0_N1 [100 Ohm Diff Mid]: J45.4 U10.7(AOUT-)
LVDS_DIN0_P1 [100 Ohm Diff Mid]: J45.17 U10.8(AOUT+)
LVDS_DIN1_N1 [100 Ohm Diff Mid]: J45.16 U10.5(BOUT-)
LVDS_DIN1_P1 [100 Ohm Diff Mid]: J45.3 U10.6(BOUT+)
LVDS_DIN2_N [100 Ohm Diff Mid]: SJ2.1 U11.7(AOUT-)
LVDS_DIN2_P [100 Ohm Diff Mid]: SJ1.1 U11.8(AOUT+)
LVDS_DOUT0_N1 [100 Ohm Diff Mid]: J45.19 R19.1 U8.1(A-)
LVDS_DOUT0_P1 [100 Ohm Diff Mid]: J45.6 R19.2 U8.2(A+)
LVDS_DOUT1_N1 [100 Ohm Diff Mid]: J45.18 R20.1 U8.7(B-)
LVDS_DOUT1_P1 [100 Ohm Diff Mid]: J45.5 R20.2 U8.6(B+)
LVDS_IN_1: U5.6(6/PWM) U8.3(AOUT) U15.1(CLK) U16.11(SRCLK)
LVDS_IN_2: U5.5(5/PWM) U8.5(BOUT) U16.14(SER)
LVDS_OUT_1: U5.17/A3(17/A3/T) U10.2(AIN) U19.9(QH)
LVDS_OUT_2: U5.7(7/RX3) U10.3(BIN) U19.2(CLK)
LVDS_OUT_3: U5.20/A6(20/A6/PWM) U11.2(AIN)
N$1 [stripline]: J1.SIG J2.CLK
N$2: U5.11(11/MOSI) U6.1X1111(MOSI_IN)
N$3 [stripline]: J3.SIG J4.CLK
N$4 [stripline]: J13.SIG J14.CLK
N$5: D1.C Q1.2(S) U1.1(COIL+)
N$6: U5.13(13/SCK/LED) U6.1X1110(SCK_IN)
N$7: U5.10(10/TX2/PWM) U6.1X119(DC_IN)
N$8: U5.14/A0 U6.1X118(RESET_IN)
N$9: U5.12(12/MISO) U6.1X117(OL_EDCS_IN)
N$10: L2.2 U12.10(OUTN)
N$11: J45.2 SJ2.COM
N$12: J45.15 SJ1.COM
N$13: R25.2 U14.8(RS)
N$14: L1.2 U12.9(OUTP)
N$15: C5.2 U1.6(NC_A)
N$16: C13.1 J43.1 U9.8(BVDD)
N$17: C13.2 J43.5 U9.5(BGND)
N$18: J43.4 U9.6(B1)
N$19 [stripline]: J10.SIG U2.5(NO_A)
N$20: U15.2(D) U15.3(!Q)
N$21: U15.5(Q) U17.1(CLK)
N$22: C6.1 R6.1
N$23: R1.1 S1.1
N$24: R29.1 U13.A4(FB2)
N$25: R27.1 U13.E4(FB1)
N$26: C27.2 U13.A3(TRACK/SS2)
N$27: C28.2 U13.E3(TRACK/SS1)
N$28 [stripline]: J9.SIG U1.5(NO_A)
N$29 [stripline]: J5.CLK U1.1X6(COM_A)
N$30: C5.1 R5.1
N$31: C6.2 U2.6(NC_A)
N$32: D3.C Q3.2(S) U3.1(COIL+)
N$33: C7.1 R7.1
N$34 [stripline]: J6.CLK U2.1X6(COM_A)
N$35: R2.2 S2.1
N$36: C7.2 U3.6(NC_A)
N$37 [stripline]: J11.SIG U3.5(NO_A)
N$38: R3.2 S3.1
N$39: D4.C Q4.2(S) U4.1(COIL+)
N$40: D2.C Q2.2(S) U2.1(COIL+)
N$41: C26.1 R24.1 R26.1 U14.5(SPLIT)
N$42: R9.2 U7.1(_INT)
N$43 [stripline]: J7.CLK U3.1X6(COM_A)
N$44: R4.2 S4.1
N$45: C8.1 R8.1
N$46: C8.2 U4.6(NC_A)
N$47 [stripline]: J12.SIG U4.5(NO_A)
N$48 [stripline]: J8.CLK U4.1X6(COM_A)
N$49: U17.2(D) U17.3(!Q)
N$50: U17.5(Q) U18.1(CLK)
N$51: U18.2(D) U18.3(!Q)
N$145: R28.1 U13.C4(FREQ)
RELAY_SENSE_1: C1.2 Q1.1(G) R1.2 U7.7(P03)
RELAY_SENSE_2: C2.2 Q2.1(G) R2.1 U7.6(P02)
RELAY_SENSE_3: C3.2 Q3.1(G) R3.1 U7.5(P01)
RELAY_SENSE_4: C4.2 Q4.1(G) R4.1 U7.4(P00)
SD_MODE: R23.1 U12.4(!SD_MODE)
SH/!LH: U5.9(9/RX2/PWM) U19.1(SH/!LH)
VO+: C22.1 J44.1 J44.4 J46.2 L1.1
VO-: C19.1 J44.5 J46.1 L2.1
Unconnected: U1.2(NC_B) U1.3(COM_B) U1.4(NO_B) U2.2(NC_B) U2.3(COM_B) U2.4(NO_B) U3.2(NC_B) U3.3(COM_B) U3.4(NO_B) U4.2(NC_B) U4.3(COM_B) U4.4(NO_B) U5.22/A8(22/A8/T/PWM) U5.23/A9(23/A9/T/PWM) U5.A14(A14/DAC) U5.PGM U6.1X113(3V3) U6.1X114(CD) U6.1X115(MISO_OUT) U6.1X116(SDCS_IN) U7.15(P10) U7.16(P11) U7.18(P13) U7.19(P14) U7.20(P15) U8.11(COUT) U8.13(DOUT) U9.3(AVDD/NC) U9.7(BGND/NC) U11.5(BOUT-) U11.6(BOUT+) U12.2(GAIN) U13.A5(COMP2) U13.B4(PGOOD2) U13.C3(INTVCC) U13.D4(PGOOD1) U13.E5(COMP1) U16.9(QH') U19.7(!QH)

## Notes on the sheet
- RF switches | CLK Feedthru
- Analog IO
- Teensy 4.0 | OLED | IO Expander
- User IO
- Digital IO
- NB: For best performance,
  quads should only be input
  or output, not mixtures.
- HARP Bus
- Host AUX
- CLKOUT signal will have the serial
  comunication/protocol that will sync
  all the Harp devices.
- Audio
- Quad 1
- Quad 2
- R1 Channel Selection:
  LEFT = VDD (0 Ohm)
  RIGHT = 370K (94*VDD-100)
  LEFT/2 + RIGHT/2 = 1.011M (222.2*VDD-100)
- Quad 3
- TP1
- TP2
- TP3
- Power
- TP4
- Gain=9dB | TP5
- ToDo: Ferrite (select w/high Z at high F,
  low Z at low F). Try to block everything
  >1MHz or so.
- NB: P,N order 
  matches SDR
  datasheet spec.
- NB: Rs set to
  allow up to 
  4 Mbps.
- NB: 3.16k =
  12V output.
- Use JLC2313 Stackup: 
  https://jlcpcb.com/client/index.html#/impedance. 0.2 mm prepeg

## Power pins joined to a net without a drawn wire
3.3V: U5.3.3V U5.3.3V1(3.3V)
VBAT: U5.VBAT

## Library data of the parts
C1-C4 C20 C29 = jonnew:C: Capacitor; MN: TDK Corp.; PARTNO: C2012X5R1Cxxxxxxx; VID: DK
C5-C19 C21-C28 C30 C33-C36 = jonnew:C: Capacitor
D1-D4 = jonnew:DIODE: DIODE
D5-D14 D16 = jonnew:TVS-DIODE-BI
D15 = jonnew:Z-DIODE: Zener Diode
J1-J20 J22-J33 J35-J40 = jonnew:COAX: COAX CONNECTOR - Edge mount BNC - Vertical BNC - Vertical SMA - etc
J21 J34 = jonnew:SCREW8: Screw Terminal
J42 J47 = con-lsta:FE10-2: FEMALE HEADER; OC_FARNELL: unknown; OC_NEWARK: unknown
J43 J44 = jonnew:STEREO_JACK
J45 = jonnew:PINHD-1X26
J46 = con-molex:22-23-2021: .100" (2.54mm) Center Header - 2 Pin; MF: MOLEX; MPN: 22-23-2021; OC_FARNELL: 1462926; OC_NEWARK: 25C3832
L1 L2 = jonnew:L: Inductor
Q1-Q4 = jonnew:N-MOSFET: N-CHANNEL MOS FET SYMBOL
R1-R29 = jonnew:R: Resistor
S1-S4 = jonnew:SPDT: SPDT Switch
S5-S8 S10 S11 = jonnew:SPST_TACT2
S9 = jonnew:C14N32P-C3
SJ1 SJ2 = jonnew:SJ2: SMD solder JUMPER
TP1-TP9 = jonnew:TP: Test pad
U1-U4 = jonnew:G6KU-2F-RF-TR09DC5
U5 = jonnew:TEENSY_3.1_BASIC: Footprint for Teensy 3.1 board using all pin connections on the outer perimeter
U6 = jonnew:ADAFRUIT_1_5_OLED
U7 = jonnew:TCA9555
U8 = jonnew:LVDS_RECEIVER_QUAD
U9 = CNP-ics 2:SI8610
U10 U11 = jonnew:LVDS_DRIVER_DUAL
U12 = microbuilder:AUDIOAMP_MAX98357: MAX98357 - 3.2W I2S Mono Audio Amp
U13 = jonnew:LTM4622
U14 = jonnew:LTC2875
U15 U17 U18 = jonnew:D-FLIP-FLOP
U16 = jonnew:SNX4HC595
U19 = jonnew:SNX4HC165
X = jonnew:OE-LOGO

## Net classes
1 stripline: width 0.48 mm, drill 0.5 mm, clearance 0.1 mm
3 100 Ohm Diff Mid: width 0.2 mm, drill 0.2 mm, clearance 0.09 mm